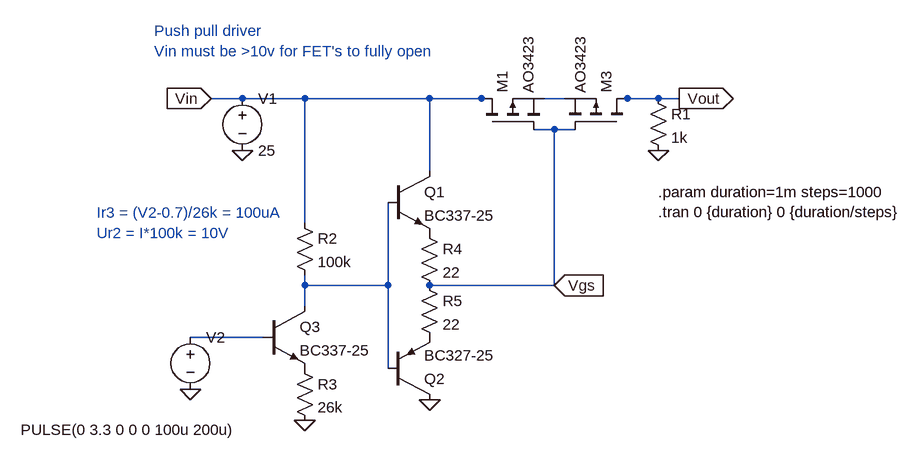
[diagram p0: schematic pmos-driver.asc]
pmos-driver.asc, the LTspice schematic file:
Version 4
SHEET 1 1196 728
WIRE 16 128 -32 128
WIRE 112 128 16 128
WIRE 304 128 112 128
WIRE 384 128 304 128
WIRE 400 128 384 128
WIRE 512 128 480 128
WIRE 608 128 592 128
WIRE 656 128 608 128
WIRE 688 128 656 128
WIRE 496 176 464 176
WIRE 528 176 496 176
WIRE 304 240 304 128
WIRE 112 320 112 128
WIRE 112 416 112 400
WIRE 240 416 240 288
WIRE 240 416 112 416
WIRE 496 416 496 176
WIRE 496 416 304 416
WIRE 112 448 112 416
WIRE 48 496 -64 496
WIRE 240 544 240 416
FLAG 16 208 0
FLAG -64 576 0
FLAG 688 128 Vout
IOPIN 688 128 Out
FLAG 304 592 0
FLAG 112 624 0
FLAG 656 208 0
FLAG 496 416 Vgs
IOPIN 496 416 In
FLAG -32 128 Vin
IOPIN -32 128 In
SYMBOL pmos 608 176 M270
SYMATTR InstName M3
SYMATTR Value AO3423
SYMBOL Voltage 16 112 R0
SYMATTR InstName V1
SYMATTR Value 25
SYMBOL Voltage -64 480 R0
WINDOW 3 -261 158 Left 2
SYMATTR Value PULSE(0 3.3 0 0 0 100u 200u)
SYMATTR InstName V2
SYMBOL npn 240 240 R0
SYMATTR InstName Q1
SYMATTR Value BC337-25
SYMBOL pnp 240 592 M180
SYMATTR InstName Q2
SYMATTR Value BC327-25
SYMBOL npn 48 448 R0
SYMATTR InstName Q3
SYMATTR Value BC337-25
SYMBOL Res 96 304 R0
SYMATTR InstName R2
SYMATTR Value 100k
SYMBOL Res 640 112 R0
SYMATTR InstName R1
SYMATTR Value 1k
SYMBOL Res 96 528 R0
SYMATTR InstName R3
SYMATTR Value 26k
SYMBOL Res 288 320 R0
SYMATTR InstName R4
SYMATTR Value 22
SYMBOL Res 288 400 R0
SYMATTR InstName R5
SYMATTR Value 22
SYMBOL pmos 384 176 R270
SYMATTR InstName M1
SYMATTR Value AO3423
TEXT 656 272 Left 2 !.param duration=1m steps=1000\n.tran 0 {duration} 0 {duration/steps}
TEXT -208 304 Left 2 ;Ir3 = (V2-0.7)/26k = 100uA\nUr2 = I*100k = 10V
TEXT -120 24 Left 2 ;Push pull driver\nVin must be >10v for FET's to fully open

The netlist it stands for:
* pmos-driver.asc
M3 Vout Vgs N001 N001 AO3423
V1 Vin 0 25
V2 N003 0 PULSE(0 3.3 0 0 0 100u 200u)
Q1 Vin N002 P001 0 BC337-25
Q2 0 N002 P002 0 BC327-25
Q3 N002 N003 P003 0 BC337-25
R2 Vin N002 100k
R1 Vout 0 1k
R3 P003 0 26k
R4 P001 Vgs 22
R5 Vgs P002 22
M1 Vin Vgs N001 N001 AO3423
.model NPN NPN
.model PNP PNP
.lib standard.bjt
.model NMOS NMOS
.model PMOS PMOS
.lib standard.mos
.param duration=1m steps=1000
.tran 0 {duration} 0 {duration/steps}
* Ir3 = (V2-0.7)/26k = 100uA
* Ur2 = I*100k = 10V
* Push pull driver
* Vin must be >10v for FET's to fully open
.backanno
.end